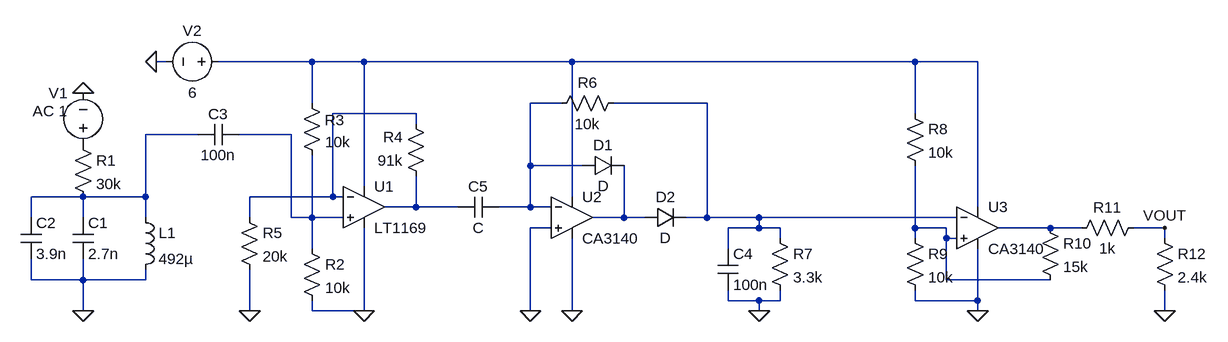
[diagram p0: schematic RF detector.asc]
RF detector.asc, the LTspice schematic file:
Version 4.1
SHEET 1 1856 680
WIRE 128 -112 112 -112
WIRE 352 -112 208 -112
WIRE 432 -112 352 -112
WIRE 752 -112 432 -112
WIRE 1280 -112 752 -112
WIRE 1376 -112 1280 -112
WIRE 352 -48 352 -112
WIRE 736 -48 688 -48
WIRE 960 -48 816 -48
WIRE 512 -32 384 -32
WIRE 1280 -32 1280 -112
WIRE 512 -16 512 -32
WIRE 176 0 96 0
WIRE 320 0 240 0
WIRE 688 48 688 -48
WIRE 768 48 688 48
WIRE 432 80 432 -112
WIRE 0 96 -80 96
WIRE 96 96 96 0
WIRE 96 96 0 96
WIRE 384 96 384 -32
WIRE 384 96 256 96
WIRE 400 96 384 96
WIRE 752 96 752 -112
WIRE 512 112 512 64
WIRE 512 112 464 112
WIRE 576 112 512 112
WIRE 688 112 688 48
WIRE 688 112 640 112
WIRE 720 112 688 112
WIRE 1376 112 1376 -112
WIRE -80 128 -80 96
WIRE 0 128 0 96
WIRE 96 128 96 96
WIRE 256 128 256 96
WIRE 320 128 320 0
WIRE 352 128 352 32
WIRE 352 128 320 128
WIRE 400 128 352 128
WIRE 832 128 832 48
WIRE 832 128 784 128
WIRE 864 128 832 128
WIRE 960 128 960 -48
WIRE 960 128 928 128
WIRE 1040 128 960 128
WIRE 1344 128 1040 128
WIRE 720 144 688 144
WIRE 1040 144 1040 128
WIRE 1040 144 992 144
WIRE 1072 144 1040 144
WIRE 1280 144 1280 48
WIRE 1328 144 1280 144
WIRE 1488 144 1408 144
WIRE 1536 144 1488 144
WIRE 1664 144 1616 144
WIRE 1072 160 1072 144
WIRE 1280 160 1280 144
WIRE 1328 160 1328 144
WIRE 1344 160 1328 160
WIRE 1664 160 1664 144
WIRE 352 176 352 128
WIRE 992 176 992 144
WIRE -80 224 -80 192
WIRE 0 224 0 192
WIRE 0 224 -80 224
WIRE 96 224 96 208
WIRE 96 224 0 224
WIRE 1328 224 1328 160
WIRE 1488 224 1328 224
WIRE 992 256 992 240
WIRE 1040 256 992 256
WIRE 1072 256 1072 240
WIRE 1072 256 1040 256
WIRE 1280 256 1280 240
WIRE 1376 256 1376 176
WIRE 1376 256 1280 256
WIRE 0 272 0 224
WIRE 256 272 256 208
WIRE 352 272 352 256
WIRE 432 272 432 144
WIRE 432 272 352 272
WIRE 688 272 688 144
WIRE 752 272 752 160
WIRE 1040 272 1040 256
WIRE 1376 272 1376 256
WIRE 1664 272 1664 240
FLAG 0 272 0
FLAG 0 -64 0
FLAG 432 272 0
FLAG 112 -112 0
FLAG 256 272 0
FLAG 688 272 0
FLAG 1040 272 0
FLAG 752 272 0
FLAG 1376 272 0
FLAG 1664 272 0
FLAG 1664 144 VOUT
SYMBOL cap -16 128 R0
SYMATTR InstName C1
SYMATTR Value 2.7n
SYMBOL cap -96 128 R0
SYMATTR InstName C2
SYMATTR Value 3.9n
SYMATTR SpiceLine V=6.3 Irms=99.5m Rser=1.1328 Lser=0 mfg="KEMET" pn="C0402C392K9RAC" type="X7R"
SYMBOL ind 80 112 R0
SYMATTR InstName L1
SYMATTR Value 492µ
SYMBOL voltage 0 32 R180
WINDOW 0 24 96 Left 2
WINDOW 3 24 16 Left 2
WINDOW 123 24 68 Left 2
WINDOW 39 0 0 Left 0
SYMATTR InstName V1
SYMATTR Value ""
SYMATTR Value2 AC 1
SYMBOL res -16 0 R0
SYMATTR InstName R1
SYMATTR Value 30k
SYMBOL cap 240 -16 R90
WINDOW 0 0 32 VBottom 2
WINDOW 3 32 32 VTop 2
SYMATTR InstName C3
SYMATTR Value 100n
SYMBOL OpAmps\\LT1169 432 48 R0
SYMATTR InstName U1
SYMBOL res 336 160 R0
SYMATTR InstName R2
SYMATTR Value 10k
SYMBOL res 336 -64 R0
WINDOW 0 51 26 Top 2
SYMATTR InstName R3
SYMATTR Value 10k
SYMBOL voltage 224 -112 R90
WINDOW 0 -32 56 VBottom 2
WINDOW 3 32 56 VTop 2
WINDOW 123 0 0 Left 0
WINDOW 39 0 0 Left 0
SYMATTR InstName V2
SYMATTR Value 6
SYMBOL res 528 80 R180
WINDOW 0 36 76 Left 2
WINDOW 3 36 40 Left 2
SYMATTR InstName R4
SYMATTR Value 91k
SYMBOL res 240 112 R0
SYMATTR InstName R5
SYMATTR Value 20k
SYMBOL diode 768 64 R270
WINDOW 0 32 32 VTop 2
WINDOW 3 0 32 VBottom 2
SYMATTR InstName D1
SYMBOL diode 864 144 R270
WINDOW 0 32 32 VTop 2
WINDOW 3 0 32 VBottom 2
SYMATTR InstName D2
SYMBOL res 832 -64 R90
WINDOW 0 0 56 VBottom 2
WINDOW 3 32 56 VTop 2
SYMATTR InstName R6
SYMATTR Value 10k
SYMBOL cap 976 176 R0
SYMATTR InstName C4
SYMATTR Value 100n
SYMBOL res 1056 144 R0
SYMATTR InstName R7
SYMATTR Value 3.3k
SYMBOL OpAmps\\opamp2 752 64 R0
SYMATTR InstName U2
SYMATTR Value CA3140
SYMBOL cap 640 96 R90
WINDOW 0 0 32 VBottom 2
WINDOW 3 32 32 VTop 2
SYMATTR InstName C5
SYMBOL OpAmps\\opamp2 1376 80 R0
SYMATTR InstName U3
SYMATTR Value CA3140
SYMBOL res 1264 -48 R0
SYMATTR InstName R8
SYMATTR Value 10k
SYMBOL res 1264 144 R0
SYMATTR InstName R9
SYMATTR Value 10k
SYMBOL res 1472 128 R0
SYMATTR InstName R10
SYMATTR Value 15k
SYMBOL res 1520 160 R270
WINDOW 0 32 56 VTop 2
WINDOW 3 0 56 VBottom 2
SYMATTR InstName R11
SYMATTR Value 1k
SYMBOL res 1648 144 R0
SYMATTR InstName R12
SYMATTR Value 2.4k

The netlist it stands for:
* RF detector.asc
C1 N005 0 2.7n
C2 N005 0 3.9n V=6.3 Irms=99.5m Rser=1.1328 Lser=0 mfg="KEMET" pn="C0402C392K9RAC" type="X7R"
L1 N005 0 492µ
V1 P001 0 AC 1
R1 P001 N005 30k
C3 N006 N005 100n
X§U1 N006 N004 N001 0 N007 LT1169  ; pins In+ In- V+ V- OUT
R2 N006 0 10k
R3 N001 N006 10k
V2 N001 0 6
R4 N007 N004 91k
R5 N004 0 20k
D1 N002 N008 D
D2 N008 N003 D
R6 N003 N002 10k
C4 N003 0 100n
R7 N003 0 3.3k
X§U2 0 N002 N001 0 N008 CA3140  ; pins In+ In- V+ V- OUT
C5 N002 N007 C
X§U3 N009 N003 N001 0 N010 CA3140  ; pins In+ In- V+ V- OUT
R8 N001 N009 10k
R9 N009 0 10k
R10 N010 N009 15k
R11 N010 VOUT 1k
R12 VOUT 0 2.4k
.model D D
.lib standard.dio
.backanno
.end